# Altium schematic sheet 4-20mA_Converter.SchDoc
size A3; SheetNumber: 3; SheetTotal: 3
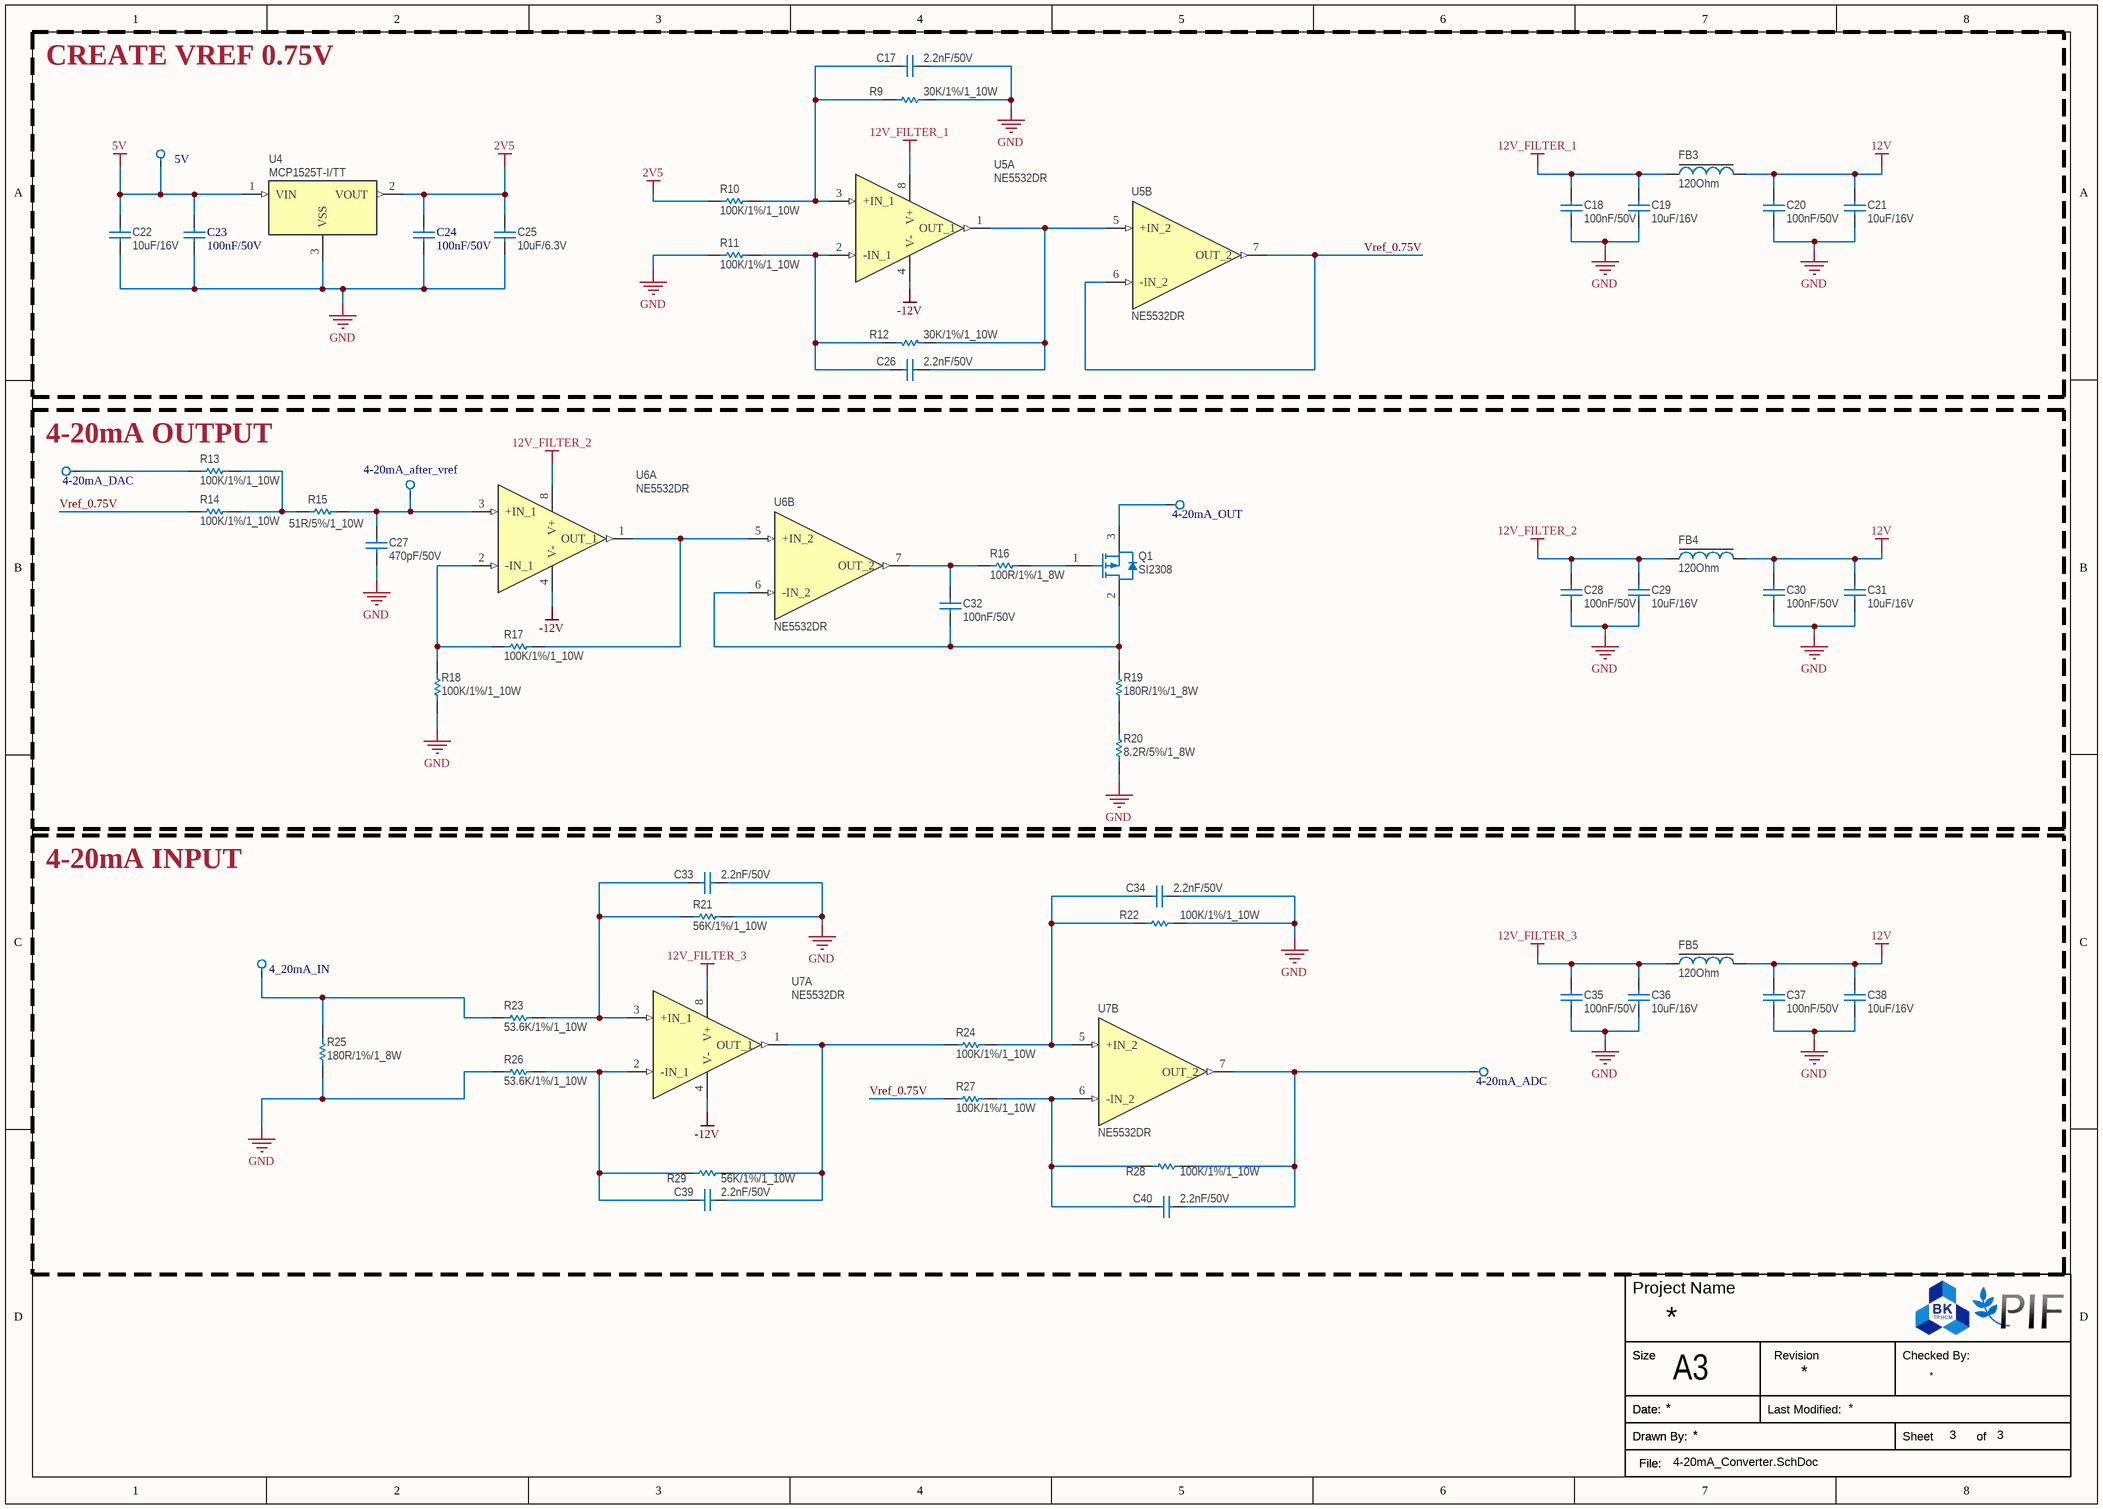
[diagram p0: 4-20mA_Converter.SchDoc]

## Parts
4-20mA_ADC  4-20mA_ADC  [TestPoint_THTPad_D1.5mm_Drill0.7mm]  (value not drawn)
4-20mA_after_vref  4-20mA_after_vref  [TestPoint_THTPad_D1.5mm_Drill0.7mm]  (value not drawn)
4-20mA_DAC  4-20mA_DAC  [TestPoint_THTPad_D1.5mm_Drill0.7mm]  (value not drawn)
4-20mA_OUT  4-20mA_OUT  [TestPoint_THTPad_D1.5mm_Drill0.7mm]  (value not drawn)
4_20mA_IN  4_20mA_IN  [TestPoint_THTPad_D1.5mm_Drill0.7mm]  (value not drawn)
5V  Testpoint_SMD  [TestPoint_Pad_3.0x3.0mm]  (value not drawn)
C17  2.2nF/50V  [CAP_0603]
C18  100nF/50V  [CAP_0603]
C19  10uF/16V  [CAP_0603]
C20  100nF/50V  [CAP_0603]
C21  10uF/16V  [CAP_0603]
C22  10uF/16V  [CAP_0603]
C23  100nF/50V  [CAP_0603]
C24  100nF/50V  [CAP_0603]
C25  10uF/6.3V  [CAP_0603]
C26  2.2nF/50V  [CAP_0603]
C27  470pF/50V  [CAP_0603]
C28  100nF/50V  [CAP_0603]
C29  10uF/16V  [CAP_0603]
C30  100nF/50V  [CAP_0603]
C31  10uF/16V  [CAP_0603]
C32  100nF/50V  [CAP_0603]
C33  2.2nF/50V  [CAP_0603]
C34  2.2nF/50V  [CAP_0603]
C35  100nF/50V  [CAP_0603]
C36  10uF/16V  [CAP_0603]
C37  100nF/50V  [CAP_0603]
C38  10uF/16V  [CAP_0603]
C39  2.2nF/50V  [CAP_0603]
C40  2.2nF/50V  [CAP_0603]
FB3  120Ohm  [Ferrite_Bead_0805]
FB4  120Ohm  [Ferrite_Bead_0805]
FB5  120Ohm  [Ferrite_Bead_0805]
Q1  SI2308  [SOT-23]
R9  30K/1%/1_10W  [Resistor_0603]
R10  100K/1%/1_10W  [Resistor_0603]
R11  100K/1%/1_10W  [Resistor_0603]
R12  30K/1%/1_10W  [Resistor_0603]
R13  100K/1%/1_10W  [Resistor_0603]
R14  100K/1%/1_10W  [Resistor_0603]
R15  51R/5%/1_10W  [Resistor_0603]
R16  100R/1%/1_8W  [Resistor_0603]
R17  100K/1%/1_10W  [Resistor_0603]
R18  100K/1%/1_10W  [Resistor_0603]
R19  180R/1%/1_8W  [Resistor_0805]
R20  8.2R/5%/1_8W  [Resistor_0805]
R21  56K/1%/1_10W  [Resistor_0603]
R22  100K/1%/1_10W  [Resistor_0603]
R23  53.6K/1%/1_10W  [Resistor_0603]
R24  100K/1%/1_10W  [Resistor_0603]
R25  180R/1%/1_8W  [Resistor_0805]
R26  53.6K/1%/1_10W  [Resistor_0603]
R27  100K/1%/1_10W  [Resistor_0603]
R28  100K/1%/1_10W  [Resistor_0603]
R29  56K/1%/1_10W  [Resistor_0603]
U4  MCP1525T-I/TT  [SOT-23]
U5  NE5532DR  [SOIC-8]  (parts A,B of 2)
U6  NE5532DR  [SOIC-8]  (parts A,B of 2)
U7  NE5532DR  [SOIC-8]  (parts A,B of 2)

## Blocks framed on the sheet
CREATE VREF 0.75V: 5V C17-C26 FB3 R9-R12 U4 U5
4-20mA OUTPUT: 4-20mA_after_vref 4-20mA_DAC 4-20mA_OUT C27-C32 FB4 Q1 R13-R20 U6
4-20mA INPUT: 4-20mA_ADC 4_20mA_IN C33-C40 FB5 R21-R29 U7

## Nets
2V5: C24.2 C25.2 R10.1 U4.2(VOUT)
5V: 5V.1 C22.2 C23.2 U4.1(VIN)
12V: C20.2 C21.2 C30.2 C31.2 C37.2 C38.2 FB3.2 FB4.2 FB5.2
12V_FILTER_1: C18.2 C19.2 FB3.1 U5.8(V+)
12V_FILTER_2: C28.2 C29.2 FB4.1 U6.8(V+)
12V_FILTER_3: C35.2 C36.2 FB5.1 U7.8(V+)
-12V: U5.4(V-) U6.4(V-) U7.4(V-)
GND: C17.2 C18.1 C19.1 C20.1 C21.1 C22.1 C23.1 C24.1 C25.1 C27.1 C28.1 C29.1 C30.1 C31.1 C33.2 C34.2 C35.1 C36.1 C37.1 C38.1 R9.2 R11.1 R18.1 R20.2 R21.2 R22.2 R25.1 R26.1 U4.3(VSS)
Vref_0.75V: R14.1 R27.1 U5.6(-IN_2) U5.7(OUT_2)
Net4-20mA_ADC_1: 4-20mA_ADC.1 C40.2 R28.2 U7.7(OUT_2)
Net4-20mA_after_vref_1: 4-20mA_after_vref.1 C27.2 R15.2 U6.3(+IN_1)
Net4-20mA_DAC_1: 4-20mA_DAC.1 R13.1
Net4-20mA_OUT_1: 4-20mA_OUT.1 Q1.3(DRAIN)
Net4_20mA_IN_1: 4_20mA_IN.1 R23.1 R25.2
NetC17_1: C17.1 R9.1 R10.2 U5.3(+IN_1)
NetC26_1: C26.1 R11.2 R12.1 U5.2(-IN_1)
NetC26_2: C26.2 R12.2 U5.1(OUT_1) U5.5(+IN_2)
NetC32_1: C32.1 Q1.2(SOURCE) R19.2 U6.6(-IN_2)
NetC32_2: C32.2 R16.1 U6.7(OUT_2)
NetC33_1: C33.1 R21.1 R23.2 U7.3(+IN_1)
NetC34_1: C34.1 R22.1 R24.2 U7.5(+IN_2)
NetC39_1: C39.1 R26.2 R29.1 U7.2(-IN_1)
NetC39_2: C39.2 R24.1 R29.2 U7.1(OUT_1)
NetC40_1: C40.1 R27.2 R28.1 U7.6(-IN_2)
NetQ1_1: Q1.1(GATE) R16.2
NetR13_2: R13.2 R14.2 R15.1
NetR17_1: R17.1 R18.2 U6.2(-IN_1)
NetR17_2: R17.2 U6.1(OUT_1) U6.5(+IN_2)
NetR19_1: R19.1 R20.1

## Notes on the sheet
- Project Name
- Size
- A3
- Revision
- Checked By:
- Drawn By:
- Date:
- File:
- Last Modified:
- Sheet
- of

## Library data of the parts
4-20mA_ADC 4-20mA_after_vref 4-20mA_DAC 4-20mA_OUT 4_20mA_IN = Testpoint_TH: Test Point TEST-1BK; Supply Name: BanLinhKien; Datasheet: *; Supply Part Number: Test Point TEST-1BK; Supply URL: https://banlinhkien.com/test-point-test1bk-mau-den-5c-p18255999.html
C17 C26 C33 C34 C39 C40 = Ceramic_Cap_2.2nF_50V_0603: CAP, size 0603, 2.2nF, 50V; Supply Part Number: CC0603KRX7R9BB222; Supply Name: tme; Datasheet: *; Supply URL: http://www.tme.vn/Product.aspx?id=1310#page=pro_info
C18 C20 C23 C24 C28 C30 C32 C35 C37 = Ceramic_Cap_100nF_50V_0603: CAP, size 0603, 100nF, 50V; Supply Part Number: Tụ Gốm 0603 100nF (0.1uF) 50V; Supply Name: Thegioiic; Datasheet: *; Supply URL: https://www.thegioiic.com/tu-gom-0603-100nf-0-1uf-50v
C19 C21 C22 C29 C31 C36 C38 = Ceramic_Cap_10uF_16V_0603: CAP, size 0603, 10uF, 16V; Supply Part Number: Tụ Gốm 0603 10uF 16V; Supply Name: Thegioiic; Datasheet: *; Supply URL: https://www.thegioiic.com/tu-gom-0603-10uf-16v
C25 = Ceramic_Cap_10uF_6.3V_0603: CAP, size 0603, 10uF, 6.3V; Supply Part Number: CC0603KRX5R5BB106; Supply Name: tme; Datasheet: *; Supply URL: http://www.tme.vn/Product.aspx?id=1165#page=pro_info
C27 = Ceramic_Cap_470pF_50V_0603: CAP, size 0603, 470pF, 50V; Supply Part Number: Tụ Gốm 0603 470pF 50V; Supply Name: Thegioiic; Datasheet: *; Supply URL: https://www.thegioiic.com/tu-gom-0603-470pf-50v
FB3-FB5 = Ferrite_Bead_120Ohm_2A_0805: Ferrite Bead, size 0805, 120Ohm, 2A; Supply Part Number: CBW201209U121T Ferrite Beads 2A 120 Ohm 0805; Supply Name: Thegioiic; Supply URL: https://www.thegioiic.com/cbw201209u121t-ferrite-beads-2a-120-ohm-0805
Q1 = SI2308: SI2308 SOT23 MOSFET N-CH 2A 60V; Supply Name: BanLinhKien; Datasheet: https://www.mouser.vn/datasheet/2/427/si2308bd-1765649.pdf; Supply Part Number: SI2308 SOT23 MOSFET N-CH 2A 60V; Supply URL: https://banlinhkien.com/si2308-sot23-mosfet-nch-2a-60v-smda8s-5c-p15289840.html
R9 R12 = Res_30K_0603_1%: Resistor 0603 30KOhm 1% 1_10W; Supply Part Number: Điện Trở 30 KOhm 0603 1%; Supply Name: LinhkienX; Supply URL: https://linhkienx.com/vi/dien-tro-30-kohm-0603-1-
R10 R11 R13 R14 R17 R18 R22 R24 R27 R28 = Res_100K_0603_1%: Resistor 0603 100KOhm 1% 1_10W; Supply Part Number: Điện Trở 100 KOhm 0603 1%; Supply Name: Thegioiic; Supply URL: https://www.thegioiic.com/dien-tro-100-kohm-0603-1-
R15 = Res_51R_0603_5%: Resistor 0603 51 Ohm 5% 1_10W; Supply Part Number: Điện Trở 51 Ohm 0603 5%; Supply Name: Thegioiic; Supply URL: https://www.thegioiic.com/dien-tro-51-ohm-0603-5-
R16 = Res_100R_0805_1%: Resistor 0805 100 Ohm 1% 1_8W; Supply Part Number: Điện Trở 100 Ohm 0805 1%; Supply Name: Thegioiic; Supply URL: https://www.thegioiic.com/dien-tro-100-ohm-0805-1-
R19 R25 = Res_180R_0805_1%: Resistor 0805 180 Ohm 1% 1_8W; Supply Part Number: Điện Trở 180 Ohm 0805 1%; Supply Name: Thegioiic; Supply URL: https://www.thegioiic.com/dien-tro-180-ohm-0805-1-
R20 = Res_8.2R_0805_5%: Resistor 0805 8.2 Ohm 5% 1_8W; Supply Part Number: Điện Trở 8.2 Ohm 0805 5%; Supply Name: Thegioiic; Supply URL: https://www.thegioiic.com/dien-tro-8-2-ohm-0805-5-
R21 R29 = Res_56K_0603_1%: Resistor 0603 56KOhm 1% 1_10W; Supply Part Number: Điện Trở 56 KOhm 0603 1%; Supply Name: Thegioiic; Supply URL: https://www.thegioiic.com/dien-tro-56-kohm-0603-1-
R23 R26 = Res_53.6K_0603_1%: Resistor 0603 53.6KOhm 1% 1_10W; Supply Part Number: Điện Trở 53.6 KOhm 0603 1%; Supply Name: Thegioiic; Supply URL: https://www.thegioiic.com/dien-tro-53-6-kohm-0603-1-
U4 = MCP1525T-I/TT: Voltage Reference IC 2.5V; Supply Part Number: MCP1525T-I/TT IC Tham Chiếu Điện Áp 2.5V SOT-23; Supply Name: Thegioiic; Datasheet: https://ww1.microchip.com/downloads/aemDocuments/documents/APID/ProductDocuments/DataSheets/21653C.pdf; Supply URL: https://www.thegioiic.com/mcp1525t-i-tt-ic-tham-chieu-dien-ap-2-5v-sot-23
U5-U7 = NE5532DR: Low Noise Single/Dual Operational Amplifier - SOIC-8; Supply Name: tme; Datasheet: https://www.ti.com/lit/ds/symlink/ne5532.pdf; Supply Part Number: NE5532DR; Supply URL: http://www.tme.vn/Product.aspx?id=2122#page=pro_info
5V = Testpoint_SMD: Datasheet: *; Supply Name: *; Supply Part Number: *; Supply URL: *